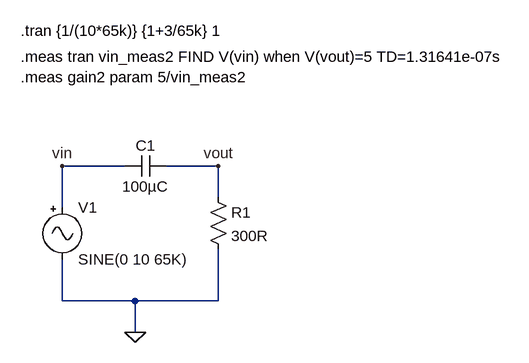
[diagram p0: schematic Draft1.asc]
Draft1.asc, the LTspice schematic file:
Version 4
SHEET 1 984 680
WIRE 384 176 288 176
WIRE 528 176 448 176
WIRE 528 224 528 176
WIRE 288 240 288 176
WIRE 288 384 288 320
WIRE 400 384 288 384
WIRE 528 384 528 304
WIRE 528 384 400 384
WIRE 400 432 400 384
FLAG 400 432 0
FLAG 528 176 vout
FLAG 288 176 vin
SYMBOL Misc/signal 288 224 R0
SYMATTR InstName V1
SYMATTR Value SINE(0 10 65K)
SYMBOL cap 448 160 R90
WINDOW 0 0 32 VBottom 2
WINDOW 3 32 32 VTop 2
SYMATTR InstName C1
SYMATTR Value 100µC
SYMBOL res 512 208 R0
SYMATTR InstName R1
SYMATTR Value 300R
TEXT 224 -32 Left 2 !.tran {1/(10*65k)} {1+3/65k} 1
TEXT 224 8 Left 2 !.meas tran vin_meas2 FIND V(vin) when V(vout)=5 TD=1.31641e-07s\n.meas gain2 param 5/vin_meas2

The netlist it stands for:
* Draft1.asc
V1 vin 0 SINE(0 10 65K)
C1 vout vin 100µC
R1 vout 0 300R
.tran {1/(10*65k)} {1+3/65k} 1
.meas tran vin_meas2 FIND V(vin) when V(vout)=5 TD=1.31641e-07s
.meas gain2 param 5/vin_meas2
.backanno
.end